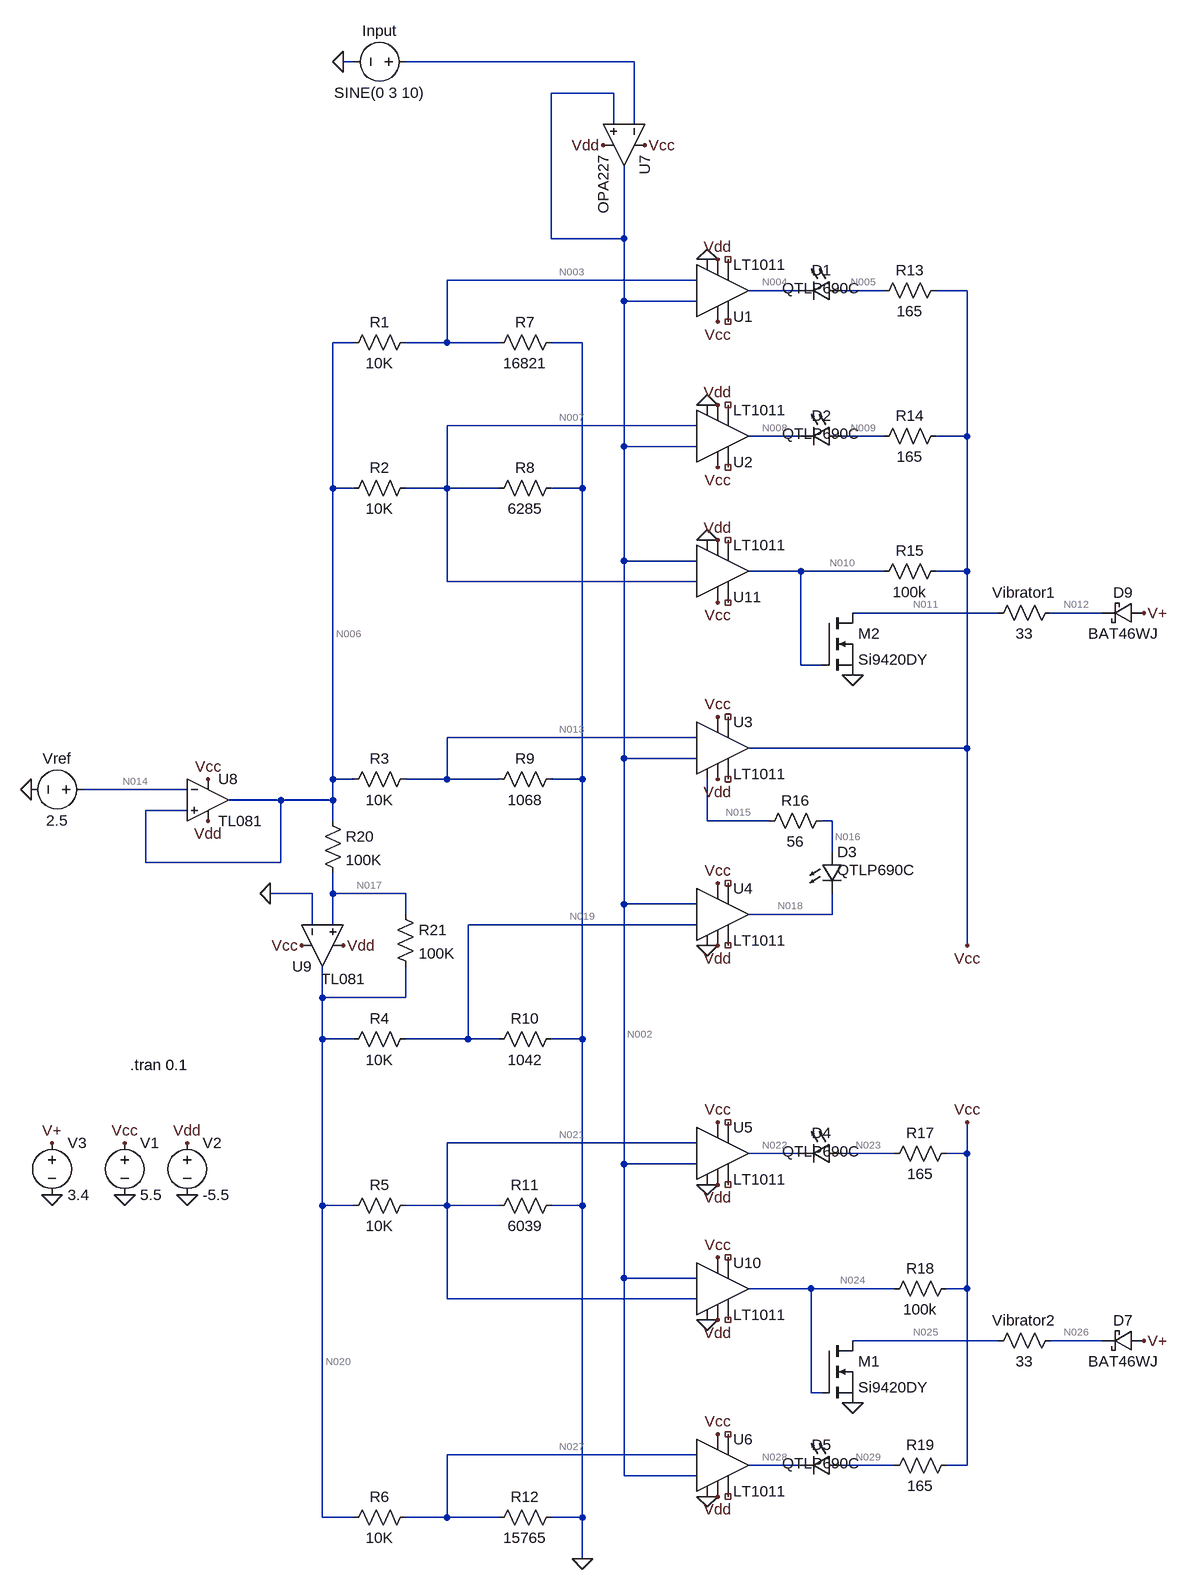
[diagram p0: schematic Komparator 27.11.15.asc]
Komparator 27.11.15.asc, the LTspice schematic file:
Version 4
SHEET 1 1912 1952
WIRE -32 -560 -48 -560
WIRE 400 -560 48 -560
WIRE 368 -512 272 -512
WIRE 368 -464 368 -512
WIRE 400 -464 400 -560
WIRE 272 -288 272 -512
WIRE 384 -288 384 -400
WIRE 384 -288 272 -288
WIRE 496 -224 112 -224
WIRE 656 -208 576 -208
WIRE 784 -208 720 -208
WIRE 912 -208 864 -208
WIRE 384 -192 384 -288
WIRE 496 -192 384 -192
WIRE -32 -128 -64 -128
WIRE 112 -128 112 -224
WIRE 112 -128 48 -128
WIRE 192 -128 112 -128
WIRE 320 -128 272 -128
WIRE 496 0 112 0
WIRE 656 16 576 16
WIRE 784 16 720 16
WIRE 912 16 912 -208
WIRE 912 16 864 16
WIRE 384 32 384 -192
WIRE 496 32 384 32
WIRE -64 96 -64 -128
WIRE -32 96 -64 96
WIRE 112 96 112 0
WIRE 112 96 48 96
WIRE 192 96 112 96
WIRE 320 96 320 -128
WIRE 320 96 272 96
WIRE 384 208 384 32
WIRE 496 208 384 208
WIRE 656 224 576 224
WIRE 784 224 656 224
WIRE 912 224 912 16
WIRE 912 224 864 224
WIRE 112 240 112 96
WIRE 496 240 112 240
WIRE 960 288 736 288
WIRE 1120 288 1040 288
WIRE 656 368 656 224
WIRE 688 368 656 368
WIRE 496 480 112 480
WIRE 912 496 912 224
WIRE 912 496 576 496
WIRE 384 512 384 208
WIRE 496 512 384 512
WIRE -64 544 -64 96
WIRE -32 544 -64 544
WIRE 112 544 112 480
WIRE 112 544 48 544
WIRE 192 544 112 544
WIRE 320 544 320 96
WIRE 320 544 272 544
WIRE -288 560 -448 560
WIRE -144 576 -224 576
WIRE -64 576 -64 544
WIRE -64 576 -144 576
WIRE -288 592 -352 592
WIRE -64 608 -64 576
WIRE 512 608 512 544
WIRE 608 608 512 608
WIRE 704 608 688 608
WIRE 704 656 704 608
WIRE -352 672 -352 592
WIRE -144 672 -144 576
WIRE -144 672 -352 672
WIRE -96 720 -160 720
WIRE -64 720 -64 688
WIRE 48 720 -64 720
WIRE 384 736 384 512
WIRE 496 736 384 736
WIRE 48 752 48 720
WIRE 704 752 704 720
WIRE 704 752 576 752
WIRE -96 768 -96 720
WIRE -64 768 -64 720
WIRE 496 768 144 768
WIRE 912 800 912 496
WIRE -80 880 -80 832
WIRE 48 880 48 832
WIRE 48 880 -80 880
WIRE -80 944 -80 880
WIRE -32 944 -80 944
WIRE 144 944 144 768
WIRE 144 944 48 944
WIRE 192 944 144 944
WIRE 320 944 320 544
WIRE 320 944 272 944
WIRE 496 1104 112 1104
WIRE 656 1120 576 1120
WIRE 800 1120 720 1120
WIRE 912 1120 912 1072
WIRE 912 1120 880 1120
WIRE 384 1136 384 736
WIRE 496 1136 384 1136
WIRE -80 1200 -80 944
WIRE -32 1200 -80 1200
WIRE 112 1200 112 1104
WIRE 112 1200 48 1200
WIRE 192 1200 112 1200
WIRE 320 1200 320 944
WIRE 320 1200 272 1200
WIRE 384 1312 384 1136
WIRE 496 1312 384 1312
WIRE 672 1328 576 1328
WIRE 800 1328 672 1328
WIRE 912 1328 912 1120
WIRE 912 1328 880 1328
WIRE 112 1344 112 1200
WIRE 496 1344 112 1344
WIRE 960 1408 736 1408
WIRE 1120 1408 1040 1408
WIRE 672 1488 672 1328
WIRE 688 1488 672 1488
WIRE 496 1584 112 1584
WIRE 656 1600 576 1600
WIRE 800 1600 720 1600
WIRE 912 1600 912 1328
WIRE 912 1600 880 1600
WIRE 384 1616 384 1312
WIRE 496 1616 384 1616
WIRE -80 1680 -80 1200
WIRE -32 1680 -80 1680
WIRE 112 1680 112 1584
WIRE 112 1680 48 1680
WIRE 192 1680 112 1680
WIRE 320 1680 320 1200
WIRE 320 1680 272 1680
WIRE 320 1744 320 1680
FLAG -48 -560 0
FLAG 512 800 0
FLAG 912 800 Vcc
FLAG 912 1072 Vcc
FLAG 528 448 Vcc
FLAG 528 704 Vcc
FLAG 528 800 Vdd
FLAG 320 1744 0
FLAG -384 1104 Vcc
FLAG -528 560 0
FLAG -160 720 0
FLAG -384 1184 0
FLAG -288 1184 0
FLAG -288 1104 Vdd
FLAG 528 544 Vdd
FLAG 416 -432 Vcc
FLAG -112 800 Vcc
FLAG -48 800 Vdd
FLAG 352 -432 Vdd
FLAG 512 -256 0
FLAG 512 -32 0
FLAG 528 64 Vcc
FLAG 528 -160 Vcc
FLAG 528 -256 Vdd
FLAG 528 -32 Vdd
FLAG 528 1552 Vcc
FLAG 528 1072 Vcc
FLAG 528 1168 Vdd
FLAG 528 1648 Vdd
FLAG 512 1168 0
FLAG 512 1648 0
FLAG -256 544 Vcc
FLAG -256 608 Vdd
FLAG 512 1376 0
FLAG 528 1376 Vdd
FLAG 528 1280 Vcc
FLAG 736 1504 0
FLAG -496 1184 0
FLAG -496 1104 V+
FLAG 1184 1408 V+
FLAG 736 384 0
FLAG 512 176 0
FLAG 1184 288 V+
FLAG 528 272 Vcc
FLAG 528 176 Vdd
SYMBOL LED 720 -224 R90
WINDOW 0 0 32 VBottom 2
WINDOW 3 28 32 VBottom 2
SYMATTR InstName D1
SYMATTR Value QTLP690C
SYMATTR Description Diode
SYMATTR Type diode
SYMBOL res 288 -144 R90
WINDOW 0 0 56 VBottom 2
WINDOW 3 32 56 VTop 2
SYMATTR InstName R7
SYMATTR Value 16821
SYMBOL res 64 -144 R90
WINDOW 0 0 56 VBottom 2
WINDOW 3 32 56 VTop 2
SYMATTR InstName R1
SYMATTR Value 10K
SYMBOL voltage 64 -560 R90
WINDOW 0 -32 56 VBottom 2
WINDOW 3 32 56 VTop 2
SYMATTR InstName Input
SYMATTR Value SINE(0 3 10)
SYMBOL res 880 -224 R90
WINDOW 0 0 56 VBottom 2
WINDOW 3 32 56 VTop 2
SYMATTR InstName R13
SYMATTR Value 165
SYMBOL res 288 80 R90
WINDOW 0 0 56 VBottom 2
WINDOW 3 32 56 VTop 2
SYMATTR InstName R8
SYMATTR Value 6285
SYMBOL res 64 80 R90
WINDOW 0 0 56 VBottom 2
WINDOW 3 32 56 VTop 2
SYMATTR InstName R2
SYMATTR Value 10K
SYMBOL res 880 0 R90
WINDOW 0 0 56 VBottom 2
WINDOW 3 32 56 VTop 2
SYMATTR InstName R14
SYMATTR Value 165
SYMBOL Comparators/LT1011 528 496 R0
SYMATTR InstName U3
SYMBOL Comparators/LT1011 528 752 R0
SYMATTR InstName U4
SYMBOL res 64 528 R90
WINDOW 0 0 56 VBottom 2
WINDOW 3 32 56 VTop 2
SYMATTR InstName R3
SYMATTR Value 10K
SYMBOL res 288 528 R90
WINDOW 0 0 56 VBottom 2
WINDOW 3 32 56 VTop 2
SYMATTR InstName R9
SYMATTR Value 1068
SYMBOL res -80 592 R0
SYMATTR InstName R20
SYMATTR Value 100K
SYMBOL res 32 736 R0
SYMATTR InstName R21
SYMATTR Value 100K
SYMBOL res 64 1184 R90
WINDOW 0 0 56 VBottom 2
WINDOW 3 32 56 VTop 2
SYMATTR InstName R5
SYMATTR Value 10K
SYMBOL res 288 1184 R90
WINDOW 0 0 56 VBottom 2
WINDOW 3 32 56 VTop 2
SYMATTR InstName R11
SYMATTR Value 6039
SYMBOL res 64 1664 R90
WINDOW 0 0 56 VBottom 2
WINDOW 3 32 56 VTop 2
SYMATTR InstName R6
SYMATTR Value 10K
SYMBOL res 288 1664 R90
WINDOW 0 0 56 VBottom 2
WINDOW 3 32 56 VTop 2
SYMATTR InstName R12
SYMATTR Value 15765
SYMBOL LED 720 1104 R90
WINDOW 0 0 32 VBottom 2
WINDOW 3 28 32 VBottom 2
SYMATTR InstName D4
SYMATTR Value QTLP690C
SYMATTR Description Diode
SYMATTR Type diode
SYMBOL LED 720 1584 R90
WINDOW 0 0 32 VBottom 2
WINDOW 3 28 32 VBottom 2
SYMATTR InstName D5
SYMATTR Value QTLP690C
SYMATTR Description Diode
SYMATTR Type diode
SYMBOL res 896 1104 R90
WINDOW 0 0 56 VBottom 2
WINDOW 3 32 56 VTop 2
SYMATTR InstName R17
SYMATTR Value 165
SYMBOL res 896 1584 R90
WINDOW 0 0 56 VBottom 2
WINDOW 3 32 56 VTop 2
SYMATTR InstName R19
SYMATTR Value 165
SYMBOL voltage -432 560 R90
WINDOW 0 -32 56 VBottom 2
WINDOW 3 32 56 VTop 2
SYMATTR InstName Vref
SYMATTR Value 2.5
SYMBOL voltage -288 1088 R0
SYMATTR InstName V2
SYMATTR Value -5.5
SYMBOL voltage -384 1088 R0
SYMATTR InstName V1
SYMATTR Value 5.5
SYMBOL res 704 592 R90
WINDOW 0 0 56 VBottom 2
WINDOW 3 32 56 VTop 2
SYMATTR InstName R16
SYMATTR Value 56
SYMBOL Opamps\\TL081 -144 800 M90
WINDOW 0 32 48 VLeft 2
WINDOW 3 51 131 VLeft 2
SYMATTR InstName U9
SYMBOL Opamps\\OPA227 448 -432 R90
SYMATTR InstName U7
SYMBOL LED 688 656 R0
WINDOW 3 24 28 Left 2
SYMATTR Value QTLP690C
SYMATTR InstName D3
SYMATTR Description Diode
SYMATTR Type diode
SYMBOL Comparators\\LT1011 528 -208 M180
SYMATTR InstName U1
SYMBOL Comparators\\LT1011 528 16 M180
SYMATTR InstName U2
SYMBOL Comparators\\LT1011 528 1120 R0
SYMATTR InstName U5
SYMBOL Comparators\\LT1011 528 1600 R0
SYMATTR InstName U6
SYMBOL res 64 928 R90
WINDOW 0 0 56 VBottom 2
WINDOW 3 32 56 VTop 2
SYMATTR InstName R4
SYMATTR Value 10K
SYMBOL res 288 928 R90
WINDOW 0 0 56 VBottom 2
WINDOW 3 32 56 VTop 2
SYMATTR InstName R10
SYMATTR Value 1042
SYMBOL LED 720 0 R90
WINDOW 0 0 32 VBottom 2
WINDOW 3 28 32 VBottom 2
SYMATTR InstName D2
SYMATTR Value QTLP690C
SYMATTR Description Diode
SYMATTR Type diode
SYMBOL Opamps\\TL081 -256 512 R0
SYMATTR InstName U8
SYMBOL Comparators\\LT1011 528 1328 R0
SYMATTR InstName U10
SYMBOL res 896 1312 R90
WINDOW 0 0 56 VBottom 2
WINDOW 3 32 56 VTop 2
SYMATTR InstName R18
SYMATTR Value 100k
SYMBOL nmos 688 1408 R0
SYMATTR InstName M1
SYMATTR Value Si9420DY
SYMBOL schottky 1184 1392 R90
WINDOW 0 0 32 VBottom 2
WINDOW 3 32 32 VTop 2
SYMATTR InstName D7
SYMATTR Value BAT46WJ
SYMATTR Description Diode
SYMATTR Type diode
SYMBOL voltage -496 1088 R0
WINDOW 123 0 0 Left 2
WINDOW 39 0 0 Left 2
SYMATTR InstName V3
SYMATTR Value 3.4
SYMBOL res 880 208 R90
WINDOW 0 0 56 VBottom 2
WINDOW 3 32 56 VTop 2
SYMATTR InstName R15
SYMATTR Value 100k
SYMBOL Comparators\\LT1011 528 224 M180
SYMATTR InstName U11
SYMBOL nmos 688 288 R0
SYMATTR InstName M2
SYMATTR Value Si9420DY
SYMBOL schottky 1184 272 R90
WINDOW 0 0 32 VBottom 2
WINDOW 3 32 32 VTop 2
SYMATTR InstName D9
SYMATTR Value BAT46WJ
SYMATTR Description Diode
SYMATTR Type diode
SYMBOL res 1056 272 R90
WINDOW 0 0 56 VBottom 2
WINDOW 3 32 56 VTop 2
SYMATTR InstName Vibrator1
SYMATTR Value 33
SYMBOL res 1056 1392 R90
WINDOW 0 0 56 VBottom 2
WINDOW 3 32 56 VTop 2
SYMATTR InstName Vibrator2
SYMATTR Value 33
TEXT -376 984 Left 2 !.tran 0.1

The netlist it stands for:
* Komparator 27.11.15.asc
D1 N005 N004 QTLP690C
R7 0 N003 16821
R1 N003 N006 10K
V§Input N001 0 SINE(0 3 10)
R13 Vcc N005 165
R8 0 N007 6285
R2 N007 N006 10K
R14 Vcc N009 165
XU3 N015 N002 N013 Vdd NC_01 NC_02 Vcc Vcc LT1011
XU4 0 N019 N002 Vdd NC_03 NC_04 N018 Vcc LT1011
R3 N013 N006 10K
R9 0 N013 1068
R20 N006 N017 100K
R21 N017 N020 100K
R5 N021 N020 10K
R11 0 N021 6039
R6 N027 N020 10K
R12 0 N027 15765
D4 N023 N022 QTLP690C
D5 N029 N028 QTLP690C
R17 Vcc N023 165
R19 Vcc N029 165
Vref N014 0 2.5
V2 Vdd 0 -5.5
V1 Vcc 0 5.5
R16 N016 N015 56
XU9 N017 0 Vcc Vdd N020 TL081  ; pins In+ In- V+ V- OUT
XU7 N002 N001 Vcc Vdd N002 OPA227  ; pins In+ In- V+ V- OUT
D3 N016 N018 QTLP690C
XU1 0 N003 N002 Vdd NC_05 NC_06 N004 Vcc LT1011
XU2 0 N007 N002 Vdd NC_07 NC_08 N008 Vcc LT1011
XU5 0 N002 N021 Vdd NC_09 NC_10 N022 Vcc LT1011
XU6 0 N002 N027 Vdd NC_11 NC_12 N028 Vcc LT1011
R4 N019 N020 10K
R10 0 N019 1042
D2 N009 N008 QTLP690C
XU8 N006 N014 Vcc Vdd N006 TL081  ; pins In+ In- V+ V- OUT
XU10 0 N021 N002 Vdd NC_13 NC_14 N024 Vcc LT1011
R18 Vcc N024 100k
M1 N025 N024 0 0 Si9420DY
D7 V+ N026 BAT46WJ
V3 V+ 0 3.4
R15 Vcc N010 100k
XU11 0 N002 N007 Vdd NC_15 NC_16 N010 Vcc LT1011
M2 N011 N010 0 0 Si9420DY
D9 V+ N012 BAT46WJ
R§Vibrator1 N012 N011 33
R§Vibrator2 N026 N025 33
.model D D
.lib standard.dio
.model NMOS NMOS
.model PMOS PMOS
.lib standard.mos
.tran 0.1
.lib LTC1.lib
.backanno
.end

* Results of the author's LTspice run, read from the files saved beside the schematic
* Operating Point, zero values left out:
*   V(n005) = 5.5 V
*   V(n004) = 4.284 V
*   V(n003) = 1.568 V
*   V(n006) = 2.5 V
*   V(vcc) = 5.5 V
*   V(n007) = 965 mV
*   V(n009) = 5.5 V
*   V(vdd) = -5.5 V
*   V(n013) = 241.2 mV
*   V(n015) = 3.234 V
*   V(n019) = -235.9 mV
*   V(n018) = 342.2 mV
*   V(n017) = 22.53 µV
*   V(n020) = -2.5 V
*   V(n021) = -941.1 mV
*   V(n027) = -1.529 V
*   V(n023) = 5.5 V
*   V(n022) = 4.284 V
*   V(n029) = 5.5 V
*   V(n028) = 4.284 V
*   V(n014) = 2.5 V
*   V(n016) = 2.255 V
*   V(n008) = 4.284 V
*   V(n024) = 150.6 mV
*   V(n025) = 3.4 V
*   V(v+) = 3.4 V
*   V(n026) = 3.4 V
*   V(n010) = 150.6 mV
*   V(n011) = 3.4 V
*   V(n012) = 3.4 V
*   Id(M2) = 20.6 pA
*   Is(M2) = -20.6 pA
*   Id(M1) = 20.6 pA
*   Is(M1) = -20.6 pA
*   I(D9) = 24 pA
*   I(D7) = 24 pA
*   I(D2) = 4.138 nA
*   I(D3) = 17.47 mA
*   I(D5) = 4.138 nA
*   I(D4) = 4.138 nA
*   I(D1) = 4.138 nA
*   I(Vibrator2) = 24 pA
*   I(Vibrator1) = 24 pA
*   I(R15) = 53.49 µA
*   I(R18) = 53.49 µA
*   I(R10) = 226.4 µA
*   I(R4) = 226.4 µA
*   I(R16) = -17.47 mA
*   I(R19) = 4.138 nA
*   I(R17) = 4.138 nA
*   I(R12) = 97.02 µA
*   I(R6) = 97.04 µA
*   I(R11) = 155.8 µA
*   I(R5) = 155.9 µA
*   I(R21) = 25 µA
*   I(R20) = 25 µA
*   I(R9) = -225.9 µA
*   I(R3) = -225.9 µA
*   I(R14) = 4.138 nA
*   I(R2) = -153.5 µA
*   I(R8) = -153.5 µA
*   I(R13) = 4.138 nA
*   I(R1) = -93.2 µA
*   I(R7) = -93.21 µA
*   I(V3) = -48 pA
*   I(V1) = -49.58 mA
*   I(V2) = 27.46 mA
*   I(Vref) = -38.06 pA
*   I(Input) = -2.535 nA
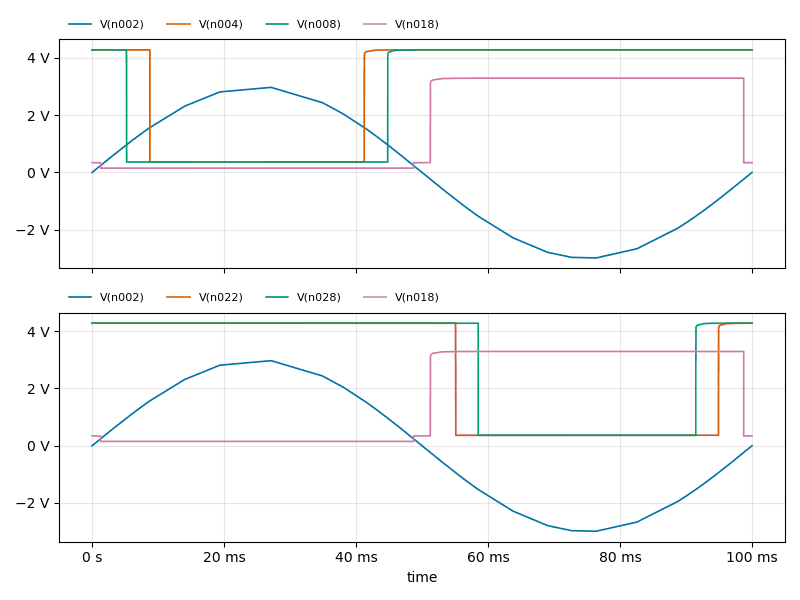
[diagram p1: Transient Analysis of Komparator 27.11.15.asc, plotted from the saved traces]
* Transient Analysis, 1 run:
*   V(n002): min -2.991 V, max 2.972 V, average -4.387 mV, rms 2.105 V, last -3.692 µV
*   V(n004): min 363.8 mV, max 4.284 V, average 3.009 V, rms 3.524 V, last 4.284 V
*   V(n008): min 363.8 mV, max 4.284 V, average 2.731 V, rms 3.336 V, last 4.284 V
*   V(n018): min 150.1 mV, max 3.294 V, average 1.652 V, rms 2.272 V, last 342.2 mV
*   V(n002): min -2.991 V, max 2.972 V, average -4.387 mV, rms 2.105 V, last -3.692 µV
*   V(n022): min 363.8 mV, max 4.284 V, average 2.721 V, rms 3.329 V, last 4.283 V
*   V(n028): min 363.8 mV, max 4.284 V, average 2.99 V, rms 3.512 V, last 4.284 V
*   V(n018): min 150.1 mV, max 3.294 V, average 1.652 V, rms 2.272 V, last 342.2 mV